# Altium schematic sheet Modbus_RTU.SchDoc
size A; SheetNumber: 5; SheetTotal: 10
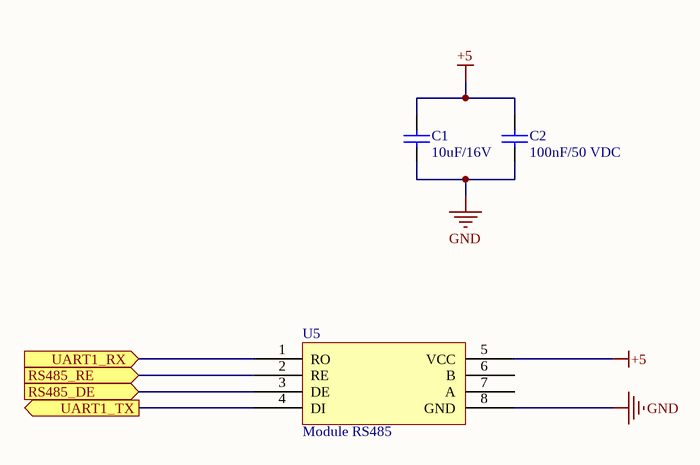
[diagram p0: Modbus_RTU.SchDoc]

## Parts
C1  10uF/16V  [CAP_0805]
C2  100nF/50 VDC  [CAP_0805]
U5  Module RS485  [MODULE_RS485]

## Ports
RS485_DE (in), RS485_RE (in), UART1_RX (in), UART1_TX (out)

## Nets
+5: C1.2 C2.2 U5.5(VCC)
GND: C1.1 C2.1 U5.8(GND)
RS485_DE: U5.3(DE) ; port RS485_DE
RS485_RE: U5.2(RE) ; port RS485_RE
UART1_RX: U5.1(RO) ; port UART1_RX
UART1_TX: U5.4(DI) ; port UART1_TX

Not connected (* = marked no-connect by the designer): U5 6(B) 7(A)

## Library data of the parts
C1 = 0108058281050: CAP, size 0805, 10uF, 16V; Tolerance: +/-5%; Voltage Rating DC: 16 VDC; ComponentLink2Description: Datasheet; Size: 0805; URL: https://www.thegioiic.com/tu-gom-0805-10uf-16v; Value: 10uF/16V
C2 = 0108058281050: CAP, size 0805, 100nF, 50 VDC; Tolerance: +/-5%; ComponentLink2Description: Datasheet; Size: 0805; URL: https://www.thegioiic.com/tu-gom-0805-100nf-0-1uf-50v; Value: 100nF/50 VDC
U5 = Module RS485: Using module through UART